# Altium schematic sheet Electromagnetic Op-Amp Board.SchDoc
size A4
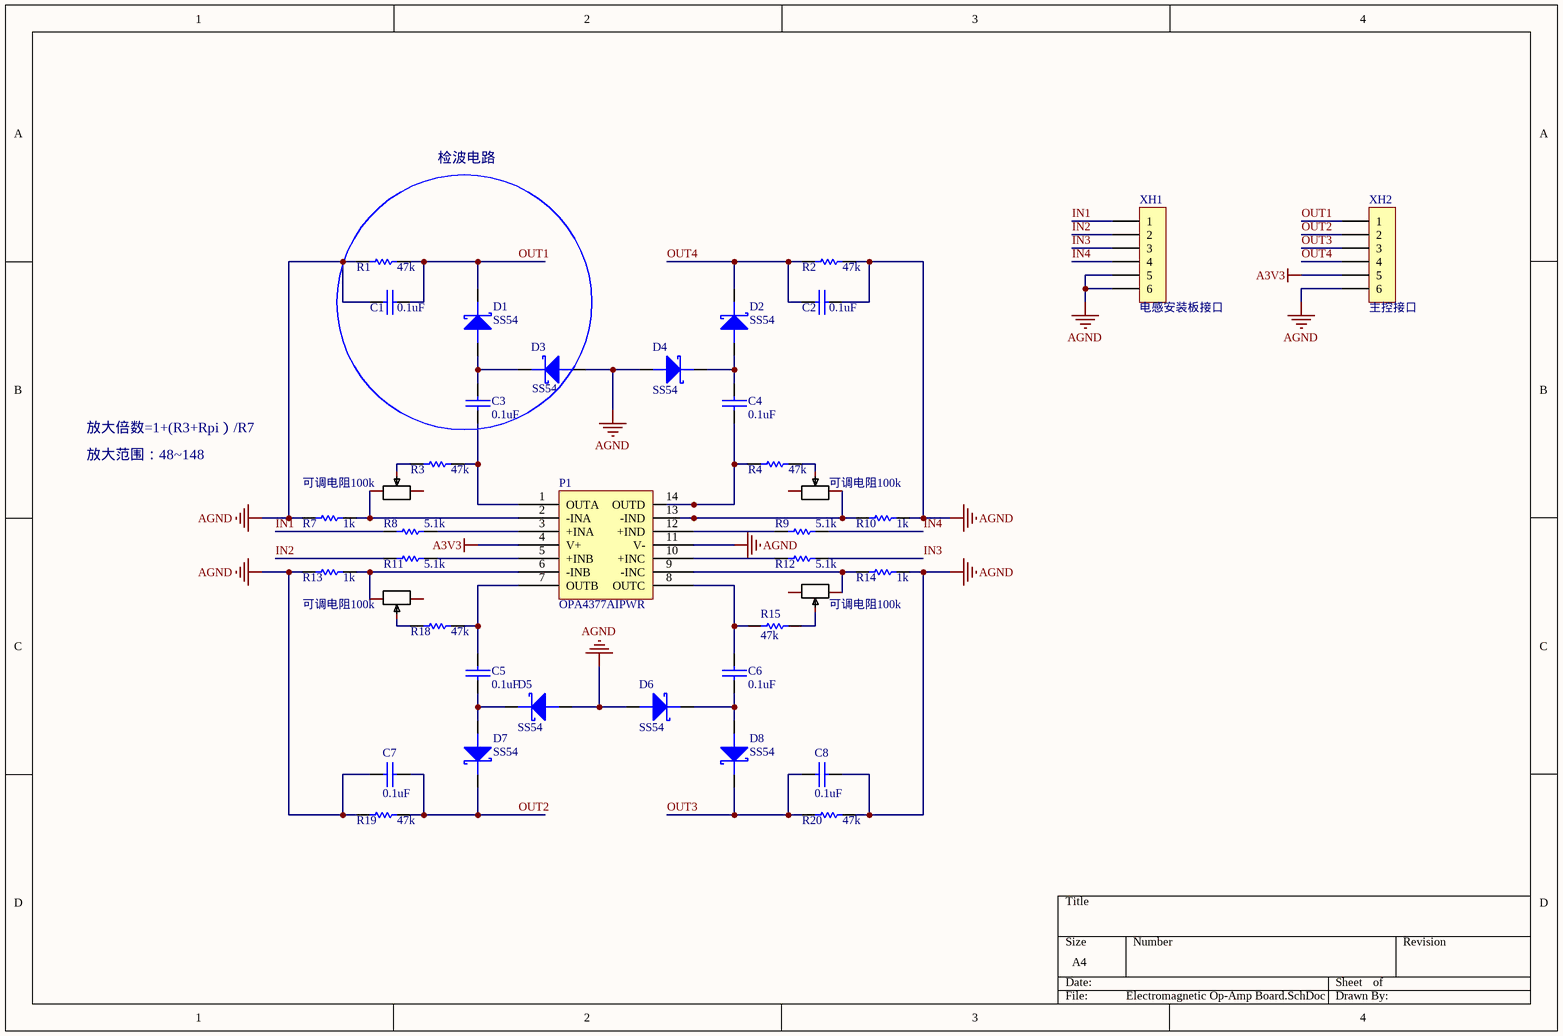
[diagram p0: Electromagnetic Op-Amp Board.SchDoc]

## Parts
C1  0.1uF  [0402C]
C2  0.1uF  [0402C]
C3  0.1uF  [0402C]
C4  0.1uF  [0402C]
C5  0.1uF  [0402C]
C6  0.1uF  [0402C]
C7  0.1uF  [0402C]
C8  0.1uF  [0402C]
D1  SS54  [SMA/DO-214AC]
D2  SS54  [SMA/DO-214AC]
D3  SS54  [SMA/DO-214AC]
D4  SS54  [SMA/DO-214AC]
D5  SS54  [SMA/DO-214AC]
D6  SS54  [SMA/DO-214AC]
D7  SS54  [SMA/DO-214AC]
D8  SS54  [SMA/DO-214AC]
P1  OPA4377AIPWR  [OPA4377AIPWR]
R1  47k  [0402R]
R2  47k  [0402R]
R3  47k  [0402R]
R4  47k  [0402R]
R5  可调电阻100k  [可调电阻100k]
R6  可调电阻100k  [可调电阻100k]
R7  1k  [0402R]
R8  5.1k  [0402R]
R9  5.1k  [0402R]
R10  1k  [0402R]
R11  5.1k  [0402R]
R12  5.1k  [0402R]
R13  1k  [0402R]
R14  1k  [0402R]
R15  47k  [0402R]
R16  可调电阻100k  [可调电阻100k]
R17  可调电阻100k  [可调电阻100k]
R18  47k  [0402R]
R19  47k  [0402R]
R20  47k  [0402R]
XH1  电感安装板接口  [XH6/2.54mm/180]
XH2  主控接口  [XH6/2.54mm/180]

## Nets
A3V3: P1.4(V+) XH2.5
AGND: C1.2 C2.1 C7.2 C8.1 D3.A D4.A D5.A D6.A P1.11(V-) R1.1 R2.2 R7.1 R10.2 R13.1 R14.2 R19.1 R20.2 XH1.5 XH1.6 XH2.6
IN1: R8.1 XH1.1
IN2: R11.1 XH1.2
IN3: R12.2 XH1.3
IN4: R9.2 XH1.4
OUT1: C1.1 D1.K R1.2 XH2.1
OUT2: C7.1 D7.K R19.2 XH2.2
OUT3: C8.2 D8.K R20.1 XH2.3
OUT4: C2.2 D2.K R2.1 XH2.4
NetC3_1: C3.1 P1.1(OUTA) R3.2
NetC3_2: C3.2 D1.A D3.K
NetC4_1: C4.1 P1.14(OUTD) R4.1
NetC4_2: C4.2 D2.A D4.K
NetC5_1: C5.1 P1.7(OUTB) R18.2
NetC5_2: C5.2 D5.K D7.A
NetC6_1: C6.1 P1.8(OUTC) R15.1
NetC6_2: C6.2 D6.K D8.A
NetP1_2: P1.2(-INA) R5.3 R7.2
NetP1_3: P1.3(+INA) R8.2
NetP1_5: P1.5(+INB) R11.2
NetP1_6: P1.6(-INB) R13.2 R17.1
NetP1_9: P1.9(-INC) R14.1 R16.3
NetP1_10: P1.10(+INC) R12.1
NetP1_12: P1.12(+IND) R9.1
NetP1_13: P1.13(-IND) R6.1 R10.1
NetR3_1: R3.1 R5.2
NetR4_2: R4.2 R6.2
NetR15_2: R15.2 R16.2
NetR17_2: R17.2 R18.1

Not connected (* = marked no-connect by the designer): R5 1; R6 3; R16 1; R17 3

## Notes on the sheet
- 检波电路
- 放大倍数=1+(R3+Rpi）/R7
- 放大范围：48~148

## Library data of the parts
C1-C8 = CAP: 无极性电容
D1-D8 = DIODE SCHOTTKY: 肖特基二极管
P1 = OPA4377AIPWR: Header, 7-Pin, Dual row; LatestRevisionDate: 17-Jul-2002; LatestRevisionNote: Re-released for DXP Platform.; Publisher: Altium Limited
R1-R4 R7-R15 R18-R20 = RES
R5 R6 R16 R17 = 可调电阻100k: Manufacturer: BOURNS; Name: 100kΩ; Symbol: 3296W-1-104LF; Add into BOM: yes; Value: 100kΩ; Tolerance: ±10%; Device: 3296W-1-104LF; LCSC Part Name: 100kΩ ±10%; Supplier Part: C48084; Manufacturer Part: 3296W-1-104LF; Supplier Footprint: 插件; JLCPCB Part Class: Extended Part; Datasheet: https://atta.szlcsc.com/upload/public/pdf/source/20150811/1457707339453.pdf; Supplier: LCSC; Convert to PCB: yes
XH1 XH2 = XH6